# Altium schematic sheet WikiToy.SchDoc
size A4
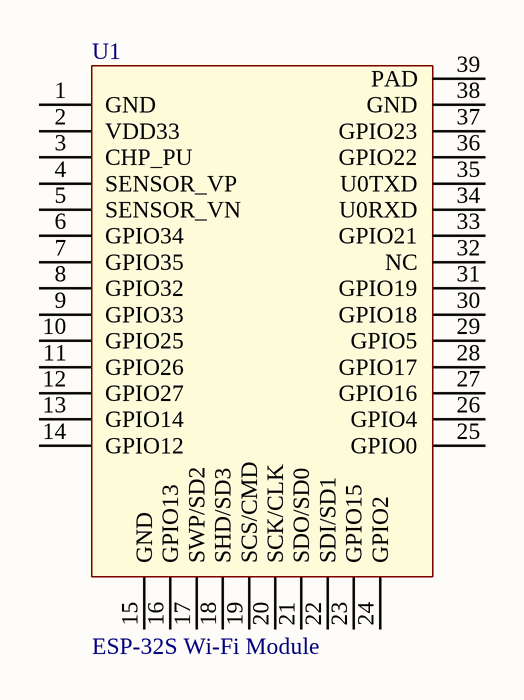
[diagram p0: WikiToy.SchDoc]

## Parts
U1  ESP-32S Wi-Fi Module  [ESP-32S]

## Nets

Not connected (* = marked no-connect by the designer): U1 1(GND) 2(VDD33) 3(CHP_PU) 4(SENSOR_VP) 5(SENSOR_VN) 6(GPIO34) 7(GPIO35) 8(GPIO32) 9(GPIO33) 10(GPIO25) 11(GPIO26) 12(GPIO27) 13(GPIO14) 14(GPIO12) 15(GND) 16(GPIO13) 17(SWP/SD2) 18(SHD/SD3) 19(SCS/CMD) 20(SCK/CLK) 21(SDO/SD0) 22(SDI/SD1) 23(GPIO15) 24(GPIO2) 25(GPIO0) 26(GPIO4) 27(GPIO16) 28(GPIO17) 29(GPIO5) 30(GPIO18) 31(GPIO19) 32(NC) 33(GPIO21) 34(U0RXD) 35(U0TXD) 36(GPIO22) 37(GPIO23) 38(GND) 39(PAD)

## Library data of the parts
U1 = ESP-32S